# EAGLE schematic fMeter-preamp (EAGLE 5.07)
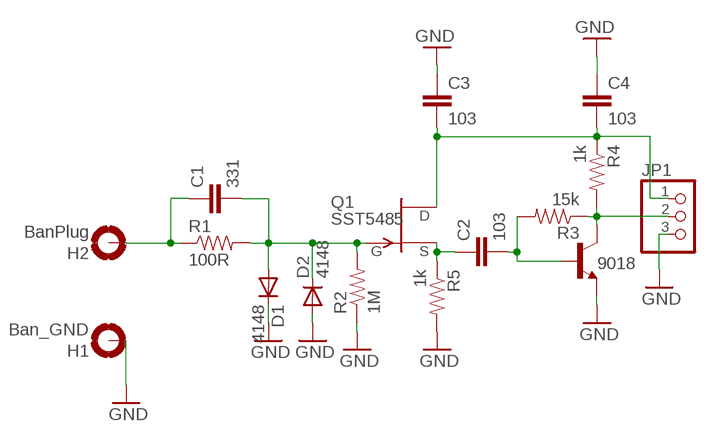
[diagram p0: schematic, sheet 1]

## Parts
9018  -NPN-TO92-EBC-SMD  [TO92-EBC-SMD]
C1  331  CAP-RF  [CAP-SMD-SMALL]
C2  103  CAP-C0805  [C0805]
C3  103  CAP-RF  [CAP-SMD-SMALL]
C4  103  CAP-RF  [CAP-SMD-SMALL]
D1  4148  DIODEIN4148-SMD  [DIODE-IN4148-SMD]
D2  4148  DIODEIN4148-SMD  [DIODE-IN4148-SMD]
H1  Ban_GND  MOUNT-PAD-ROUND5.5  [5,5-PAD]
H2  BanPlug  MOUNT-PAD-ROUND5.5  [5,5-PAD]
JP1  PINHD-1X3/90  [1X03/90]
Q1  SST5485  [SOT23]
R1  100R  RESISTOR1/4W-RF  [AXIAL-0.3-SMD]
R2  1M  RESISTOR1/4W-RF  [AXIAL-0.3-SMD]
R3  15k  RESISTOR0805  [0805]
R4  1k  RESISTOR1/4W-RF  [AXIAL-0.3-SMD]
R5  1k  RESISTOR1/4W-RF  [AXIAL-0.3-SMD]

## Nets
GND: 9018.E C3.P$1 C4.P$1 D1.C D2.A H1.B5,5(MOUNT) JP1.3 R2.P$1 R5.P$2
N$1: C1.P$1 H2.B5,5(MOUNT) R1.P$1
N$2: C1.P$2 D1.A D2.C Q1.3(G) R1.P$2 R2.P$2
N$3: C2.1 Q1.2(S) R5.P$1
N$4: 9018.B C2.2 R3.2
N$5: 9018.C JP1.2 R3.1 R4.P$2
N$7: C3.P$2 C4.P$2 JP1.1 Q1.1(D) R4.P$1

## Library data of the parts
9018 = digital-toy:*-NPN-: NPN Transistror most of sot-23 use the pacages sot23-BEC, top C, left B, right E. by hyl, digital-toy. and to-92 use ebc(from-top) by hyl, digital-toy.
C1-C4 = digital-toy:CAP: Capacitor Standard 0603 ceramic capacitor, and 0.1" leaded capacitor.
D1 D2 = digital-toy:DIODE: Diode These are standard reverse protection diodes and small signal diodes. SMA package can handle up to about 1A. SOD-323 can handle about 200mA. What the SOD-323 package when ordering, there are some mfgs out there that are 5-pin packages.
H1 H2 = holes:MOUNT-PAD-ROUND: MOUNTING PAD, round
JP1 = pinhead:PINHD-1X3: PIN HEADER
Q1 = transistor-fet:?548*: N-Channel JFETs Source: VISHAY 2N5484.pdf Compatible: TO92 2N5245 J304 J305 U310 J308 J309 J310 TO72 2N4416 2N4416A 2N3823 2N4351 3N169 3N170 3N171 MFE3002 TO18 2N3796 2N3797 MFE825 Source: Motorola European Master Guide Pacge 3-59
R1-R5 = digital-toy:RESISTOR: Resistor Basic schematic elements and footprints for 0603, 1206, and PTH 1/10th watt (small) resistors. digital-toy copy vertical mount of axial-0.3 from rcl.lbr : the 0207/xx